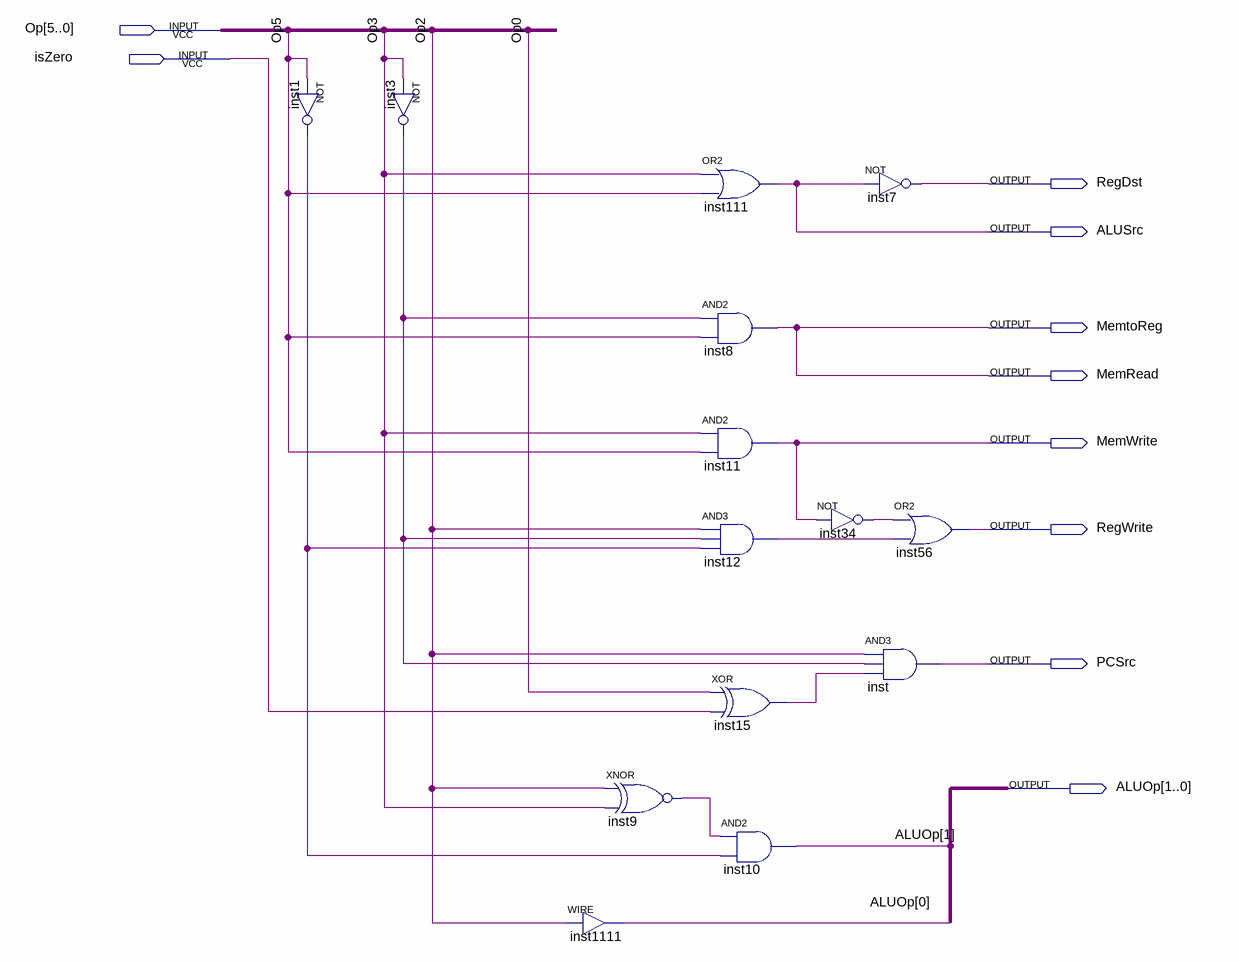
[diagram p0: schematic sheet]
// Quartus schematic Controller.bdf as structural Verilog: 14 symbols, 10 pins
module Controller (
  input  [5:0] Op,
  input  isZero,
  output RegDst,
  output ALUSrc,
  output MemtoReg,
  output MemRead,
  output MemWrite,
  output RegWrite,
  output PCSrc,
  output [1:0] ALUOp
);

  wire inst1_out, inst3_out, inst9_out, inst12_out, inst15_out, inst34_out;

  not inst1 (inst1_out, Op[5]);
  not inst3 (inst3_out, Op[3]);
  xnor inst9 (inst9_out, Op[2], Op[3]);
  assign ALUOp[0] = Op[2];  // WIRE inst1111
  or inst111 (ALUSrc, Op[3], Op[5]);
  and inst8 (MemRead, inst3_out, Op[5]);
  and inst11 (MemWrite, Op[3], Op[5]);
  and inst12 (inst12_out, Op[2], inst3_out, inst1_out);
  xor inst15 (inst15_out, Op[0], isZero);
  and inst10 (ALUOp[1], inst9_out, inst1_out);
  not inst7 (RegDst, ALUSrc);
  not inst34 (inst34_out, MemWrite);
  and inst (PCSrc, Op[2], inst3_out, inst15_out);
  or inst56 (RegWrite, inst34_out, inst12_out);

  assign MemtoReg = MemRead;
endmodule
